# EAGLE design BrainA2-B-11Nov2014 (EAGLE 7.1.0)
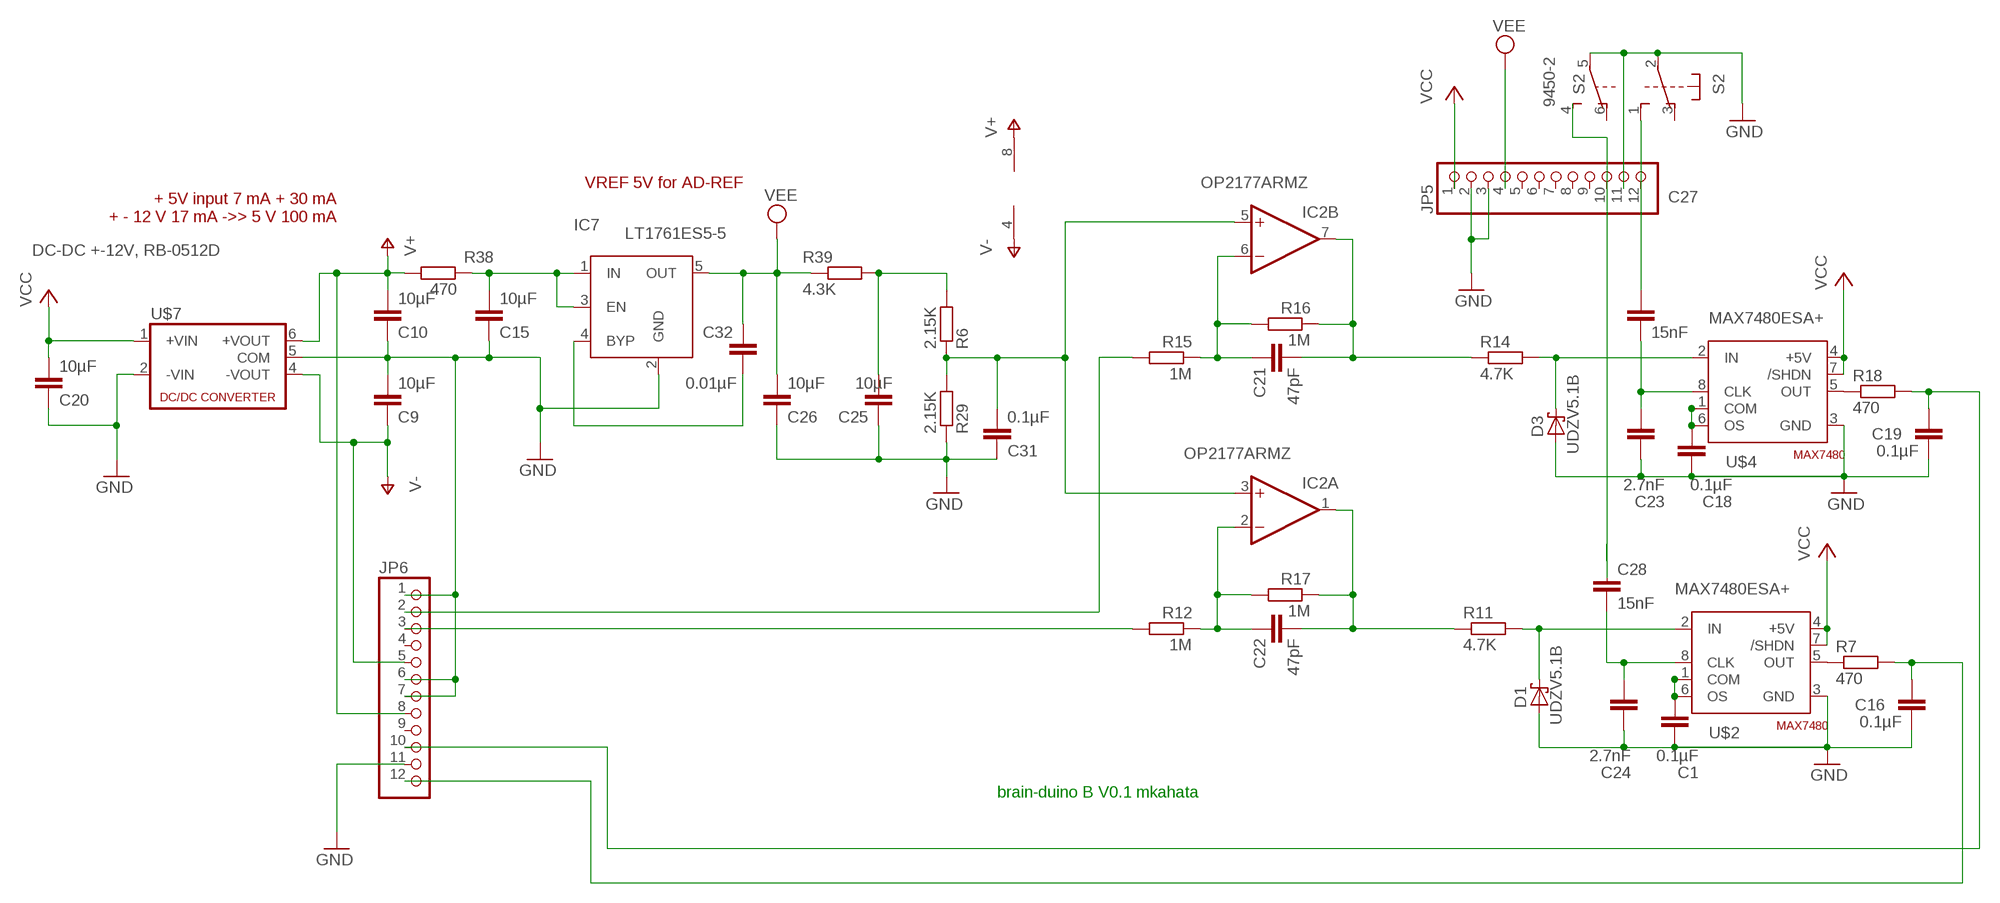
[diagram p0: schematic, sheet 1]

## Parts
C1  0.1µF  C-EUC0603  [C0603]
C9  10µF  C-EUC0603  [C0603]
C10  10µF  C-EUC0603  [C0603]
C15  10µF  C-EUC0603  [C0603]
C16  0.1µF  C-EUC0603  [C0603]
C18  0.1µF  C-EUC0603  [C0603]
C19  0.1µF  C-EUC0603  [C0603]
C20  10µF  C-EUC0603  [C0603]
C21  47pF  C-EUC0603  [C0603]
C22  47pF  C-EUC0603  [C0603]
C23  2.7nF  C-EUC0603  [C0603]
C24  2.7nF  C-EUC0603  [C0603]
C25  10µF  C-EUC0603  [C0603]
C26  10µF  C-EUC0603  [C0603]
C27  15nF  C-EUC0603  [C0603]
C28  15nF  C-EUC0603  [C0603]
C31  0.1µF  C-EUC0603  [C0603]
C32  0.01µF  C-EUC0603  [C0603]
D1  UDZV5.1B  BAT60J  [SOD323_ST]
D3  UDZV5.1B  BAT60J  [SOD323_ST]
IC2  OP2177ARMZ  OP1277RM  [MSOP08]
IC7  LT1761ES5-5  MIC5219XX  [SOT23-5]
JP5  PINHD-1X12  [1X12]
JP6  PINHD-1X12  [1X12]
R6  2.15K  R-EU_R0603  [R0603]
R7  470  R-EU_R0603  [R0603]
R11  4.7K  R-EU_R0603  [R0603]
R12  1M  R-EU_R0603  [R0603]
R14  4.7K  R-EU_R0603  [R0603]
R15  1M  R-EU_R0603  [R0603]
R16  1M  R-EU_R0603  [R0603]
R17  1M  R-EU_R0603  [R0603]
R18  470  R-EU_R0603  [R0603]
R29  2.15K  R-EU_R0603  [R0603]
R38  470  R-EU_R0603  [R0603]
R39  4.3K  R-EU_R0603  [R0603]
S2  9450-2  [9450-2]
U$2  MAX7480ESA+  MAX7480  [MAX7480]
U$4  MAX7480ESA+  MAX7480  [MAX7480]
U$7  DC-DC +-12V, RB-0512D  RB-0515D  [RB-0515D]

## Nets
GND: C1.1 C9.2 C10.1 C15.1 C16.1 C18.1 C19.1 C20.1 C23.1 C24.1 C25.1 C26.1 C31.1 D1.A D3.A IC7.2(GND) JP5.2 JP5.3 JP5.11 JP6.1 JP6.6 JP6.7 JP6.11 R29.1 S2.2(1:P) S2.5(2:P) U$2.3(GND) U$4.3(GND) U$7.2(-VIN) U$7.5(COM)
N$2: C16.2 JP6.12 R7.2
N$6: C1.2 U$2.1(COM) U$2.6(OS)
N$10: C19.2 JP6.10 R18.2
N$11: D3.C R14.2 U$4.2(IN)
N$13: R7.1 U$2.5(OUT)
N$14: D1.C R11.2 U$2.2(IN)
N$15: C24.2 C28.2 U$2.8(CLK)
N$16: C22.1 IC2.2(A:-IN) R12.1 R17.2
N$18: JP6.2 R15.2
N$19: JP6.3 R12.2
N$20: C22.2 IC2.1(A:OUT) R11.1 R17.1
N$21: C21.1 IC2.6(B:-IN) R15.1 R16.2
N$22: C21.2 IC2.7(B:OUT) R14.1 R16.1
N$31: C27.1 JP5.12 S2.1(1:S)
N$33: C28.1 JP5.10 S2.4(2:S)
N$39: C18.2 U$4.1(COM) U$4.6(OS)
N$46: R18.1 U$4.5(OUT)
N$56: C15.2 IC7.1(IN) IC7.3(EN) R38.2
N$75: C25.2 R6.2 R39.2
N$82: C32.1 IC7.4(BYP)
N$90: C31.2 IC2.3(A:+IN) IC2.5(B:+IN) R6.1 R29.2
N$91: C23.2 C27.2 U$4.8(CLK)
V+: C10.2 IC2.8(P:V+) JP6.8 R38.1 U$7.6(+VOUT)
V-: C9.1 IC2.4(P:V-) JP6.5 U$7.4(-VOUT)
VCC: C20.2 JP5.1 U$2.4(+5V) U$2.7(/SHDN) U$4.4(+5V) U$4.7(/SHDN) U$7.1(+VIN)
VEE: C26.2 C32.2 IC7.5(OUT) JP5.4 R39.1
Unconnected: JP5.5 JP5.6 JP5.7 JP5.8 JP5.9 JP6.4 JP6.9 S2.3(1:O) S2.6(2:O)

## Notes on the sheet
- VREF 5V for AD-REF
- + 5V input 7 mA + 30 mA
  + - 12 V 17 mA ->> 5 V 100 mA
- brain-duino B V0.1 mkahata

## Library data of the parts
C1 C9 C10 C15 C16 C18-C28 C31 C32 = rcl:C-EU: CAPACITOR, European symbol
D1 D3 = diode:BAT60J: Schottky barrier diode Source: www.st.com, BAT60J.pdf
IC2 = linear:OP1277: Precision Low Noise, Low Input Bias Current Operational Amplifiers Source: OP1177_2177_4177.pdf
IC7 = v-reg-micrel:MIC5219XX: VOLTAGE REGULATOR; OC_FARNELL: unknown; OC_NEWARK: unknown
JP5 JP6 = pinhead:PINHD-1X12: PIN HEADER
R6 R7 R11 R12 R14-R18 R29 R38 R39 = rcl:R-EU_: RESISTOR, European symbol
S2 = switch-misc:9450-2: MARQUARDT SWITCH
U$2 U$4 = MKH:MAX7480: Switched-Capacitor Filter
U$7 = MKH:RB-0515D: 1kVDC / 2kVDC Isolation DC-DC Converter

## Net classes
0 default: clearance 0.205 mm

## Board
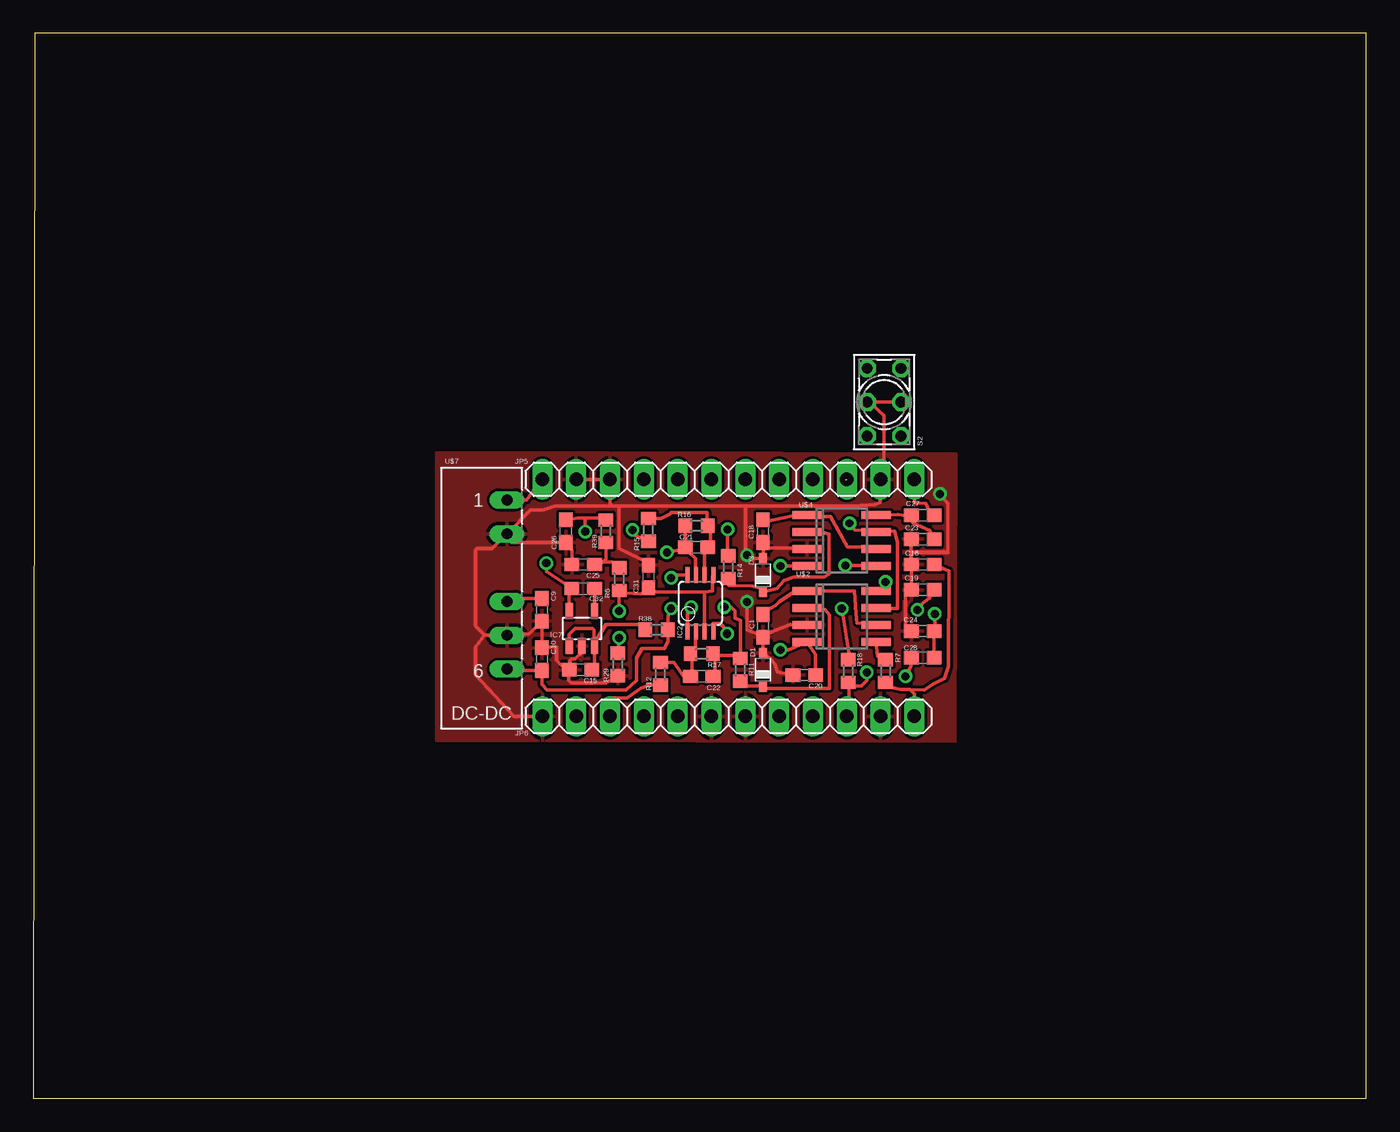
[diagram p1: board, top side]
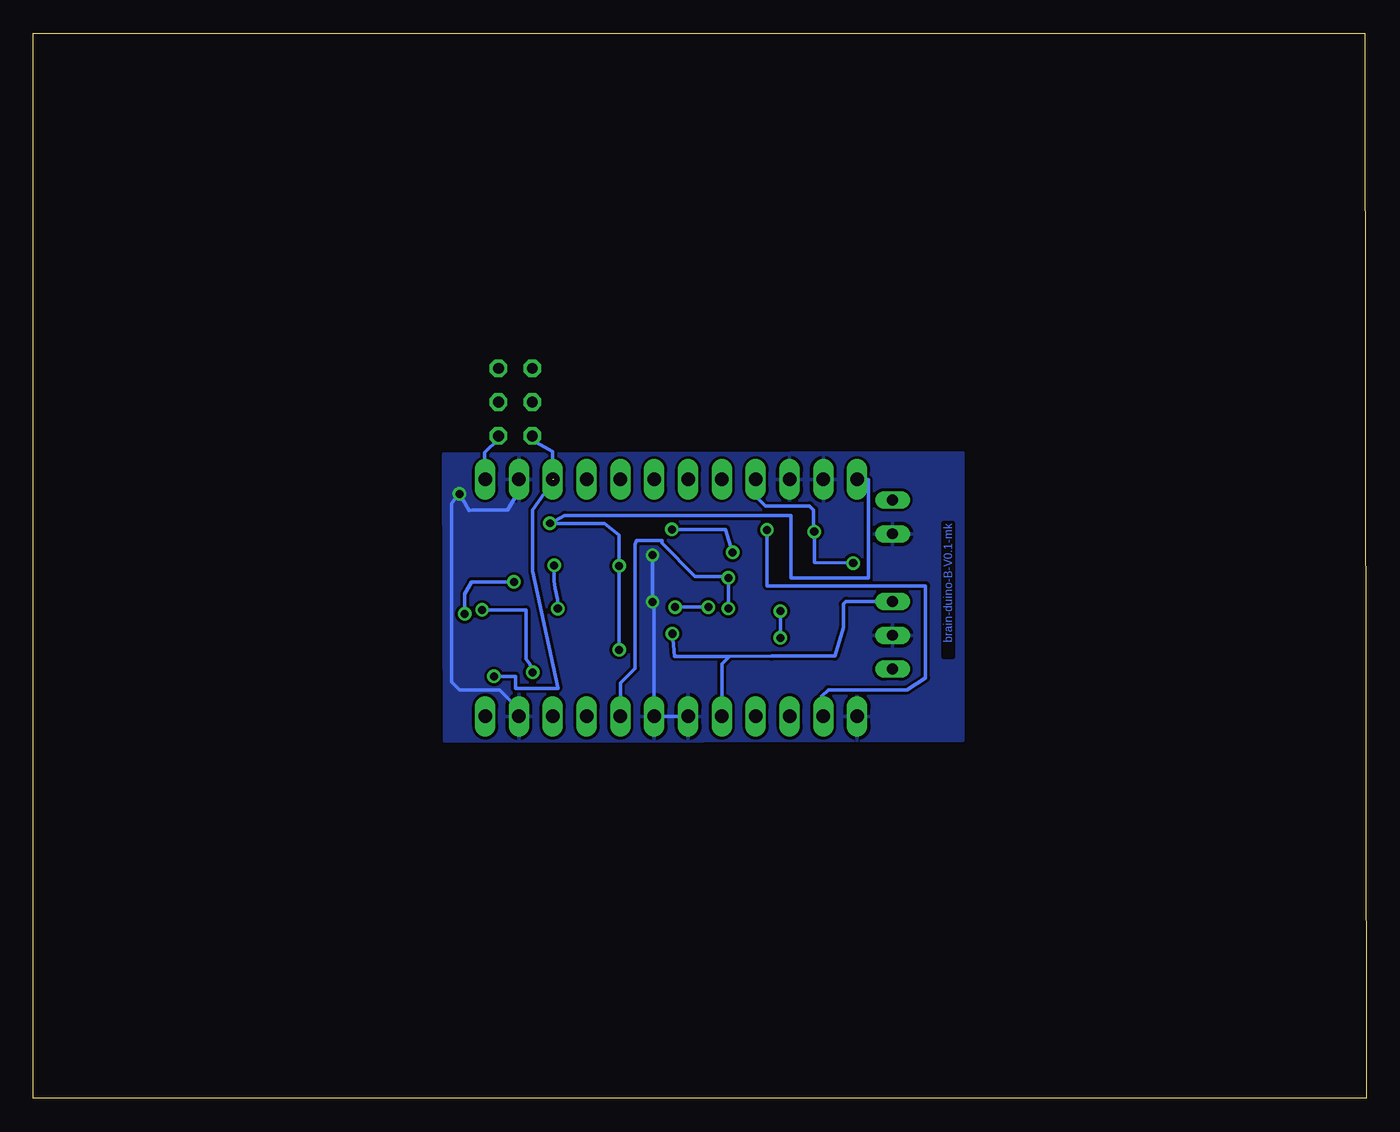
[diagram p2: board, bottom side, seen from below]

Size 100.1 x 80 mm. Coordinates in mm from the lower left corner, seen from the top.
Outline: 0,0 100.1,0 100.1,80 0.1,80 0,0
Copper layers (1*16): Top 0.035mm / dielectric 1.5mm / Bottom 0.035mm
Design rules "default": minimum track width 10mil, minimum drill 24mil, track to track 8mil, track to pad 8mil, pad to pad 8mil, via to via 8mil, smd to smd 8mil, copper to edge 40mil, drill to drill 8mil, minimum pad ring 10mil, minimum via ring 8mil, stop-mask expansion 4mil, vias tented up to drill 0mil, thermal gap 10mil

### Footprints (pad centres in the part's own frame; a part is rotated, then mirrored left to right if it is on the bottom)
C0603 = smd 1.1 x 1: 1 -0.85,0; 2 0.85,0
SOD323_ST = smd 0.8 x 0.6: A 1.25,0; C -1.25,0
MSOP08 = smd 0.3 x 1.2: 1 -0.976,-2.113; 2 -0.326,-2.113; 3 0.324,-2.113; 4 0.974,-2.113; 5 0.974,2.112; 6 0.324,2.112; 7 -0.326,2.112; 8 -0.976,2.112
SOT23-5 = smd 0.55 x 1.2: 1 -0.95,-1.3; 2 0,-1.3; 3 0.95,-1.3; 4 0.95,1.3; 5 -0.95,1.3
1X12 = drill 1.016 long: 1 -13.97,0; 2 -11.43,0; 3 -8.89,0; 4 -6.35,0; 5 -3.81,0; 6 -1.27,0; 7 1.27,0; 8 3.81,0; 9 6.35,0; 10 8.89,0; 11 11.43,0; 12 13.97,0
R0603 = smd 1 x 1.1: 1 -0.85,0; 2 0.85,0
9450-2 = drill 0.813 octagon: 1 -2.54,-1.27; 2 0,-1.27; 3 2.54,-1.27; 4 -2.54,1.27; 5 0,1.27; 6 2.54,1.27
MAX7480 = smd 0.6 x 2.2: 1 -1.905,-2.6; 2 -0.635,-2.6; 3 0.635,-2.6; 4 1.905,-2.6; 5 1.905,2.6; 6 0.635,2.6; 7 -0.635,2.6; 8 -1.905,2.6
RB-0515D = drill 0.813 long: 1 1.27,6.35; 2 1.27,3.81; 4 1.27,-1.27; 5 1.27,-3.81; 6 1.27,-6.35

### Placement (x,y rotation side)
C1  54.8,35.5 90 top
C9  38.2,36.7 270 top
C10  38.2,33 270 top
C15  41.1,32.2 0 top
C16  66.8,40.1 0 top
C18  54.8,42.6 90 top
C19  66.8,38.2 0 top
C20  57.9,31.8 0 top
C21  49.8,41.4 180 top
C22  50.2,31.7 0 top
C23  66.8,42 0 top
C24  66.8,35.1 0 top
C25  41.3,40.1 0 top
C26  40,42.6 90 top
C27  66.8,43.8 180 top
C28  66.8,33.1 0 top
C31  46.2,39.2 270 top
C32  41.3,38.3 180 top
D1  54.8,32.2 90 top
D3  54.8,39.3 90 top
IC2  50.1,37.2 0 top
IC7  41.2,35.3 0 top
JP5  52.2,46.5 0 top
JP6  52.2,28.7 0 top
R6  44,39 90 top
R7  64,32.1 270 top
R11  53.1,32.2 270 top
R12  47.1,31.9 270 top
R14  52.2,39.9 270 top
R15  46.2,42.7 270 top
R16  49.8,43 0 top
R17  50.2,33.4 180 top
R18  61.2,32.1 270 top
R29  43.9,32.6 90 top
R38  46.8,35.2 180 top
R39  43,42.6 270 top
S2  63.9,52.3 90 top
U$2  60.7,36.2 270 top
U$4  60.7,41.9 270 top
U$7  34.3,38.6 0 top

### Tracks (layer width: path | path; a pad name or v marks a point on that pad's centre or on a via)
GND  (via drill 0.6)
  Top 0.254: 65.92,41.03 65.92,41.04 67.65,41.04 68.38,41.07 | 65.92,40.78 65.92,39.86 C16.1 C19.1 65.5,37.8 65.5,35.1 C24.1 | 65.92,41.03 C23.1 | 55.52,35.09 54.82,34.71 D1.A 55.35,33.05 55.7,32.6 55.9,32.05 C20.1 | 55.52,35.09 56.85,35.59 U$2.3 57.23,35.66 57.1,35.6 57.3,35.7 | 55.52,35.09 C1.1 55.15,34.9 54.4,34.9 53.6,35.2 v53.6,37.3 | 63.66,46.47 63.66,46.46 JP5.11 | D3.A 54.82,41.42 54.82,41.57 C18.1 55.2,41.35 57.11,41.35 58.05,41.42 U$4.3 58.44,41.37 58.5,41.3 | 54.95,40.73 D3.A | R29.1 43.05,31.25 42.1,31.2 40.4,31.2 40.2,31.4 40.2,32.15 | 40.2,32.15 C15.1 40.3,32.25 40.3,32.9 40.4,33 40.7,33 41.2,33.5 IC7.2 | S2.5 62.8,52.3 | S2.2 62.8,52.3 | 62.8,52.3 63.9,51.3 63.9,46.77 JP5.11 | U$7.2 35.93,41.75 C26.1 40.3,41.3 40.45,41.15 C25.1 | 35.55,34.85 35.6,34.9 37.25,34.9 C9.2 C10.1 38.25,33.9 39.3,33.9 39.3,32.9 40.05,32.15 40.2,32.15 | 35.55,34.85 35.5,34.8 33.9,34.8 | 33.9,34.8 33.2,35.5 33.2,41.2 33.3,41.3 34.46,41.3 U$7.2 | 65.92,41.03 65.92,40.78 | 65.92,40.78 65.9,41 68.7,41 68.7,44.7 v68.1,45.4 | 53.5,44.5 44,44.5 | 44,44.5 43.5,44.5 | 43.5,44.5 39.2,44.5 38.3,44.2 37.36,44.2 U$7.2 | 53.5,44.5 61.6,44.5 63.2,44.6 63.6,44.77 JP5.11 | 53.5,44.5 53.5,40.9 v53.6,40.8 53.85,40.55 D3.A | C31.1 46.2,40.2 44,41.3 44,44.5 | U$7.5 35.57,34.83 35.55,34.85 | C24.1 65.95,35.05 65.7,34.8 65.8,35.15 C24.1 | JP6.1 36.1,28.7 33.2,31.8 33.2,33.9 33.9,34.8 | JP5.2 JP5.3 43.31,44.69 43.5,44.5
  Bottom 0.254: v53.6,40.8 v53.6,37.3 53.47,37.17 JP6.7 JP6.6 | 67.38,44.23 67.38,44.17 | 67.38,44.17 67.1,44.2 64.5,44.2 63.5,45.8 63.5,46.37 JP5.11 | 67.38,44.17 67.88,45.02 v68.1,45.4 68.3,45.2 68.7,44.7 68.7,31.3 68.1,30.7 65.1,30.7 63.63,29.23 JP6.11
  pour Top: 30.3,48.5 69.3,48.4 69.2,26.8 30.3,26.9
  pour Bottom: 30.3,48.5 69.3,48.4 69.2,26.8 30.3,26.9
N$2
  Top 0.254: 65.83,30.73 66.94,30.7 67.5,31.1 68.44,31.53 68.74,32.45 68.76,39.63 C16.2 | 65.83,30.73 65.11,30.73 64.16,30.93 64.41,30.88 64.16,31.07 R7.2 | JP6.12 66.17,30.38 65.83,30.73
N$6
  Top 0.254: C1.2 55.22,36.72 55.74,37.02 56.03,37.31 57.25,38.11 U$2.1 61.68,38.11 61.77,36.41 61.86,35.72 63.2,35.62 U$2.6
N$10  (via drill 0.6)
  Top 0.254: C19.2 67.25,37.55 66.8,37.2 v66.4,36.7 | v62.6,32 62.6,31.4 62.2,31 61.25,31 | 61.25,31 R18.2 | 61.25,31 61.25,28.86 JP6.10
  Bottom 0.254: v66.4,36.7 63.1,36.7 63.1,33 62.8,32.6 v62.6,32
N$11
  Top 0.254: R14.2 52.26,38.53 53.99,38.5 54.72,38.3 D3.C 55.85,38.3 56.37,38.9 57.13,39.16 59.43,39.16 59.75,39.39 59.75,42.38 58.97,42.57 58.28,42.57 U$4.2
N$13
  Top 0.254: U$2.5 63.4,33.25 R7.1
N$14
  Top 0.254: R11.2 53.16,31.22 53.39,30.99 54.59,30.99 D1.C 54.85,30.8 59.8,30.8 59.8,36.3 59.47,36.73 U$2.2
N$15  (via drill 0.6)
  Top 0.254: C28.2 C24.2 67.7,35.55 v67.7,36.4 | U$2.8 64,38.2 v64,38.8
  Bottom 0.254: v64,38.8 67.2,38.8 67.7,37.9 v67.7,36.4
N$16
  Top 0.254: R12.1 48.12,32.74 49.03,31.45 49.46,31.62 C22.1 49.49,31.82 49.49,33.05 R17.2 49.49,33.28 49.72,33.51 49.72,34.89 IC2.2
N$18  (via drill 0.6)
  Top 0.254: R15.2 46.15,41.85 45.1,42.3 v45,42.7
  Bottom 0.254: v45,42.7 45,38.5 33.1,38.5 33.1,31.6 34.5,30.7 40.4,30.7 40.9,30.2 40.9,28.83 JP6.2
N$19
  Top 0.254: R12.2 46.25,31.05 45.6,30.8 44.6,30.1 43.3,30.1 JP6.3
N$20  (via drill 0.6)
  Top 0.254: C22.2 51.19,31.92 51.19,33.26 | 51.19,33.26 R17.1 | 51.19,33.26 52.89,33.26 R11.1 53.1,35.9 52.7,36.1 52.7,36.6 52.4,36.9 v51.9,36.9 | IC2.1 49.12,36.42 49.3,36.9 v49.4,36.9
  Bottom 0.254: v51.9,36.9 v49.4,36.9
N$21
  Top 0.254: IC2.6 50.4,39.48 50.4,40.85 50.36,41.31 C21.1 50.86,41.34 50.86,43.18 R16.2 50.6,43.25 50.6,44 47.9,44 47.8,43.9 47.6,43.8 47.15,43.55 R15.1
N$22  (via drill 0.61)
  Top 0.254: v52.14,42.74 52.13,41.05 52.33,40.8 R14.1 | v47.58,41.01 49.03,41.31 C21.2 | R16.1 49.26,43.38 48.96,42.94 C21.2 | IC2.7 49.72,39.48 49.72,40.55 49.26,41.01 C21.2
  Bottom 0.254: v52.14,42.74 48.11,42.74 v47.58,41.01
N$31
  Top 0.254: C27.1 67.53,43.55 67.03,44.69 66.18,44.73 JP5.12
  Bottom 0.254: S2.1 65.17,49.53 66.2,48.5 66.2,46.53 JP5.12
N$33  (via drill 0.6)  (1 unrouted)
  Top 0.254: v65.5,31.7 65.9,32.45 C28.1
  Bottom 0.254: S2.4 62.66,49.46 61.1,48.6 61.1,46.71 JP5.10 | 61,46.5 62.6,44.2 62.6,39.6 60.7,30.8 63.9,30.8 63.9,31.7 v65.5,31.7
N$39
  Top 0.254: C18.2 55.22,43.38 58.02,43.98 58.05,43.95 U$4.1 58.28,43.72 59.87,43.72 61.16,41.42 63.1,41.42 U$4.6
N$46  (via drill 0.61)
  Top 0.254: v60.71,36.79 61.25,33.43 61.15,32.8 R18.1 | v60.99,40.03 62.08,40.03 63.1,40.05 U$4.5
  Bottom 0.254: v60.71,36.79 60.71,37.49 60.91,38.35 60.99,38.88 v60.99,40.03
N$56
  Top 0.254: IC7.1 40.25,34.85 40.7,35.3 42,35.3 42.1,35.2 42.1,34.05 IC7.3 | IC7.3 42.15,32.4 C15.2 | IC7.3 42,34 43,35.6 45.75,35.6 R38.2
N$75
  Top 0.254: R39.2 43,40.5 42.7,40.2 42.25,40.2 C25.2 42.5,40.3 43.5,40.3 R6.2
N$82
  Top 0.254: IC7.4 C32.1
N$90  (via drill 0.6)
  Top 0.254: IC2.3 50.42,38.02 | 50.42,38.02 51,38.1 51,39.24 IC2.5 | 50.42,38.02 46.7,38.05 C31.2 46.1,38.25 45.6,37.9 44.45,37.95 R6.1 v44,36.6 | v44,34.6 R29.2
  Bottom 0.254: v44,36.6 v44,34.6
N$91
  Top 0.254: U$4.8 64.93,43.85 65.72,43.75 C27.2 66.05,43.22 67.33,42.64 67.63,41.76 C23.2
V+  (via drill 0.6)
  Top 0.254: 35.62,32.2 U$7.6 35.67,32.15 C10.2 38.2,31.1 38.6,30.7 44.5,30.7 45.3,31.4 45.3,33.1 45.7,33.8 47.4,33.8 47.65,34.35 R38.1 47.65,36.2 v47.9,36.8 | IC2.8 48.01,39.31 47.9,39.2 v47.9,39.1
  Bottom 0.254: v47.9,36.8 v47.9,39.1 48,39.2 50.4,39.2 52.9,41.7 52.9,41.9 54.8,41.9 54.9,41.6 54.9,32.3 56.01,31.19 JP6.8
V-  (via drill 0.61)
  Top 0.254: v52.1,34.91 51.8,35.49 51.51,35.67 51.55,35.67 51.06,35.69 51.06,35.21 IC2.4 | C9.1 35.59,37.55 U$7.4
  Bottom 0.254: 35.6,37.37 U$7.4 39.07,37.34 39.26,37.14 39.26,35.37 39.91,33.22 44.65,33.22 47.8,33.21 | v52.1,34.91 51.94,33.21 47.8,33.21 | JP6.5 48.39,32.62 47.8,33.21
VCC  (via drill 0.6)
  Top 0.254: U$7.1 35.9,44.95 37.04,44.95 38.12,46.42 JP5.1 | C20.2 58.75,33.34 U$2.4 56.7,33.7 v56.1,33.7 | v61.3,43.2 61.7,42.7 62.66,42.63 U$4.7 64.66,42.63 64.9,41.8 64.9,36.8 63.47,36.8 U$2.7 | v56.1,40 57.6,40 57.51,40.1 U$4.4 58.11,40.09
  Bottom 0.254: JP5.1 38.2,46.47 37.4,46.47 37.4,39.1 43.2,39.1 43.2,43.8 60.2,43.8 v61.3,43.2 57.2,43.2 56.1,42.3 v56.1,40 v56.1,33.7
VEE  (via drill 0.61)
  Top 0.254: 41.45,43.58 43.43,43.58 R39.1 | 41.45,43.58 40.91,43.58 C26.2 | IC7.5 40.24,36.99 40.24,38.09 C32.2 38.55,39.59 v38.53,40.21 | v41.45,42.57 41.45,43.58
  Bottom 0.254: v38.53,40.21 41.45,40.24 v41.45,42.57 41.5,42.62 41.5,44.2 41.8,44.5 45.1,44.5 45.85,45.25 JP5.4

### Text on the board
Bottom: brain-duino-B-V0.1-mk